# Altium schematic sheet Power.SchDoc
size A4
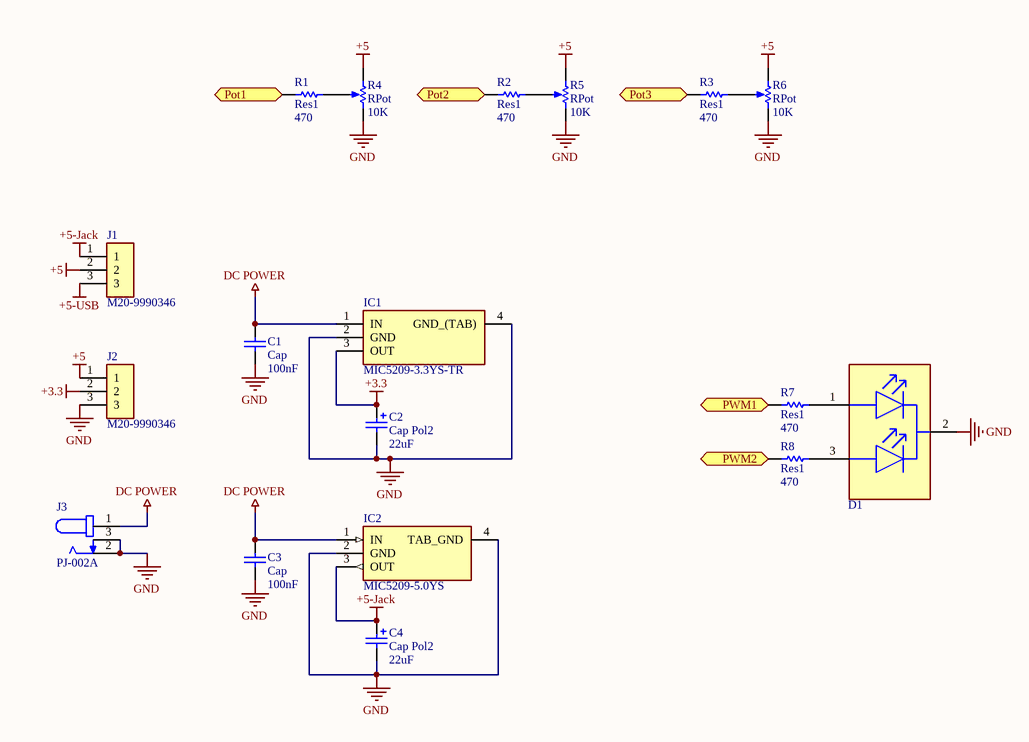
[diagram p0: Power.SchDoc]

## Parts
C1  Cap  value 100nF  [Cap 100nF]
C2  Cap Pol2  value 22uF  [CAP+ 22UF]
C3  Cap  value 100nF  [Cap 100nF]
C4  Cap Pol2  value 22uF  [CAP+ 22UF]
D1  LTL1BEKVJNN  [Bicolor LED]  (value not drawn)
IC1  MIC5209-3.3YS-TR  [LDO]
IC2  MIC5209-5.0YS  [LDO]
J1  M20-9990346  [header 3 pins male]
J2  M20-9990346  [Header 3 pins fem.]
J3  PJ-002A  [DC Jack]
R1  Res1  value 470  [Resistor 1210]
R2  Res1  value 470  [Resistor 1210]
R3  Res1  value 470  [Resistor 1210]
R4  RPot  value 10K  [POT]
R5  RPot  value 10K  [POT]
R6  RPot  value 10K  [POT]
R7  Res1  value 470  [Resistor 1210]
R8  Res1  value 470  [Resistor 1210]

## Ports
Pot1 (bidir), Pot2 (bidir), Pot3 (bidir), PWM1 (bidir), PWM2 (bidir)

## Nets
+3.3: C2.1 IC1.3(OUT) J2.2
+5: J1.2 J2.1 R4.1(TOP) R5.1(TOP) R6.1(TOP)
+5-Jack: C4.1 IC2.3(OUT) J1.1
+5-USB: J1.3
DC POWER: C1.1 C3.1 IC1.1(IN) IC2.1(IN) J3.1
GND: C1.2 C2.2 C3.2 C4.2 D1.2(COMMON_CATHODE) IC1.2(GND) IC1.4(GND_(TAB)) IC2.2(GND) IC2.4(TAB_GND) J2.3 J3.2 J3.3 R4.2(BOT) R5.2(BOT) R6.2(BOT)
Pot1: R1.1 ; port Pot1
Pot2: R2.1 ; port Pot2
Pot3: R3.1 ; port Pot3
PWM1: R7.1 ; port PWM1
PWM2: R8.1 ; port PWM2
NetD1_1: D1.1(RED_A) R7.2
NetD1_3: D1.3(GREEN_A) R8.2
NetR1_2: R1.2 R4.3(TAP)
NetR2_2: R2.2 R5.3(TAP)
NetR3_2: R3.2 R6.3(TAP)

## Library data of the parts
C1 C3 = Cap: Capacitor; Published: 8-Jun-2000; LatestRevisionDate: 17-Jul-2002; LatestRevisionNote: Re-released for DXP Platform.; PackageReference: RAD-0.3; Publisher: Altium Limited; PackageDescription: Radial Cap, Thru-Hole; 2 Leads; 0.3 in Pin Spacing
C2 C4 = Cap Pol2: Polarized Capacitor (Axial); Published: 8-Jun-2000; LatestRevisionDate: 17-Jul-2002; LatestRevisionNote: Re-released for DXP Platform.; PackageReference: POLAR0.8; Publisher: Altium Limited; PackageDescription: Polarized Capacitor; 2 Leads
IC1 = MIC5209-3.3YS-TR: Integrated Circuit; Manufacturer_Name: Microchip; Datasheet Link: http://ww1.microchip.com/downloads/en/DeviceDoc/mic5209.pdf; Height: 1.7mm; Manufacturer_Part_Number: MIC5209-3.3YS-TR; Arrow Part Number: MIC5209-3.3YS-TR; Arrow Price/Stock: https://www.arrow.com/en/products/mic5209-3.3ys-tr/microchip-technology; Mouser Part Number: 998-MIC5209-3.3YSTR; Mouser Price/Stock: https://www.mouser.co.uk/ProductDetail/Microchip-Technology-Micrel/MIC5209-33YS-TR?qs=U6T8BxXiZAXms9mvoyYO%2FQ%3D%3D
IC2 = MIC5209-5.0YS: Integrated Circuit; Manufacturer_Name: Microchip; Datasheet Link: http://www.micrel.com/_PDF/mic5209.pdf; Height: 1.8mm; Manufacturer_Part_Number: MIC5209-5.0YS; Arrow Part Number: MIC5209-5.0YS; Arrow Price/Stock: https://www.arrow.com/en/products/mic5209-5.0ys/microchip-technology; Mouser Part Number: 998-MIC5209-5.0YS; Mouser Price/Stock: https://www.mouser.com/Search/Refine.aspx?Keyword=998-MIC5209-5.0YS
J1 J2 = M20-9990346: Connector; Manufacturer_Name: Harwin; Datasheet Link: http://uk.rs-online.com/web/p/products/7457068; Height: 8.64mm; Manufacturer_Part_Number: M20-9990346; Mouser Part Number: 855-M20-9990346; Mouser Price/Stock: https://www.mouser.co.uk/ProductDetail/Harwin/M20-9990346?qs=ulE8k0yEMYbyhQ3uXpFs8Q%3D%3D
J3 = PJ-002A: DC jack; MF: CUI Devices; Package: None; Price: None; CUI_purchase_URL: https://www.cuidevices.com/product/interconnect/connectors/dc-power-connectors/jacks/pj-002a?utm_source=snapeda.com&utm_medium=referral&utm_campaign=snapedaBOM; SnapEDA_Link: https://www.snapeda.com/parts/PJ-002A/CUI%20Devices/view-part/287588/?ref=snap; Availability: Unavailable; Value: *; MP: PJ-002A
R1-R3 R7 R8 = Res1: Resistor; Published: 8-Jun-2000; LatestRevisionDate: 17-Jul-2002; LatestRevisionNote: Re-released for DXP Platform.; PackageReference: AXIAL-0.3; Publisher: Altium Limited; PackageDescription: Axial Device, Thru-Hole; 2 Leads; 0.3 in Pin Spacing
R4-R6 = RPot: Potentiometer; Sim Note: Enter the Resistance value and the set point into parameter fields.; Set Position: 0.5; Published: 8-Jun-2000; LatestRevisionDate: 17-Jul-2002; LatestRevisionNote: Re-released for DXP Platform.; PackageReference: VR5; Publisher: Altium Limited; PackageDescription: Variable Resistor, Thru-Hole; 3 Leads